# EAGLE design lpmon (EAGLE 9.2.2)
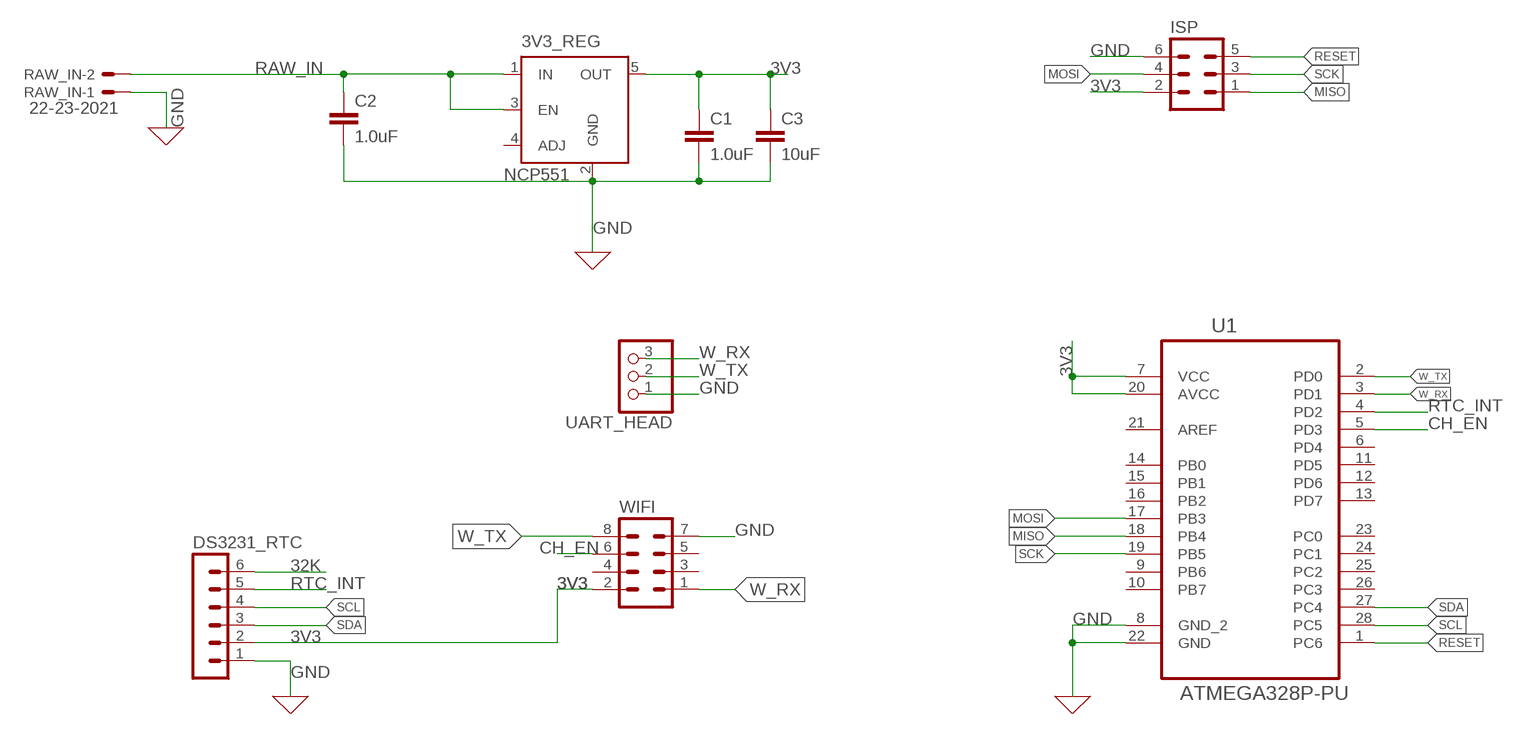
[diagram p0: schematic, sheet 1]

## Parts
3V3_REG  NCP551  MIC5219BM5  [SOT23-5]
C1  1.0uF  C2.5/2  [C2.5-2]
C2  1.0uF  C2.5/2  [C2.5-2]
C3  10uF  C2.5/2  [C2.5-2]
DS3231_RTC  MA06-1  [MA06-1]
ISP  MA03-2  [MA03-2]
RAW_IN  22-23-2021  [22-23-2021]
U1  ATMEGA328P-PU  [DIP254P762X457-28]
UART_HEAD  PINHD-1X3  [1X03]
WIFI  MA04-2  [MA04-2]

## Nets
3V3: 3V3_REG.5(OUT) C1.1 C3.1 DS3231_RTC.2 ISP.2 U1.7(VCC) U1.20(AVCC) WIFI.2
32K: DS3231_RTC.6
CH_EN: U1.5(PD3) WIFI.6
GND: 3V3_REG.2(GND) C1.2 C2.2 C3.2 DS3231_RTC.1 ISP.6 RAW_IN.1 U1.8(GND_2) U1.22(GND) UART_HEAD.1 WIFI.7
MISO: ISP.1 U1.18(PB4)
MOSI: ISP.4 U1.17(PB3)
RAW_IN: 3V3_REG.1(IN) 3V3_REG.3(EN) C2.1 RAW_IN.2
RESET: ISP.5 U1.1(PC6)
RTC_INT: DS3231_RTC.5 U1.4(PD2)
SCK: ISP.3 U1.19(PB5)
SCL: DS3231_RTC.4 U1.28(PC5)
SDA: DS3231_RTC.3 U1.27(PC4)
W_RX: U1.3(PD1) UART_HEAD.3 WIFI.1
W_TX: U1.2(PD0) UART_HEAD.2 WIFI.8
Unconnected: 3V3_REG.4(ADJ) U1.6(PD4) U1.9(PB6) U1.10(PB7) U1.11(PD5) U1.12(PD6) U1.13(PD7) U1.14(PB0) U1.15(PB1) U1.16(PB2) U1.21(AREF) U1.23(PC0) U1.24(PC1) U1.25(PC2) U1.26(PC3) WIFI.3 WIFI.4 WIFI.5

## Library data of the parts
3V3_REG = v-reg-micrel:MIC5219BM5: VOLTAGE REGULATOR; MF: ALTERA CORPORATION; MPN: MIC5219BM5 TR; OC_FARNELL: 1100656; OC_NEWARK: 09J8939
C1-C3 = capacitor-wima:C: CAPACITOR naming: grid - package width
DS3231_RTC = con-lstb:MA06-1: PIN HEADER; OC_FARNELL: unknown; OC_NEWARK: unknown
ISP = con-lstb:MA03-2: PIN HEADER; OC_FARNELL: unknown; OC_NEWARK: unknown
RAW_IN = con-molex:22-23-2021: .100" (2.54mm) Center Header - 2 Pin; MF: MOLEX; MPN: 22-23-2021; OC_FARNELL: 1462926; OC_NEWARK: 25C3832
U1 = Atmel_By_element14_Batch_1-00:ATMEGA328P-PU: 8-bit Microcontroller with In-System Programmable Flash; MPN: ATMEGA328P-PU; OC_FARNELL: 1715487; OC_NEWARK: 15R0268; PACKAGE: PDIP-28; SUPPLIER: Atmel
UART_HEAD = pinhead:PINHD-1X3: PIN HEADER
WIFI = con-lstb:MA04-2: PIN HEADER; OC_FARNELL: unknown; OC_NEWARK: unknown

## Board
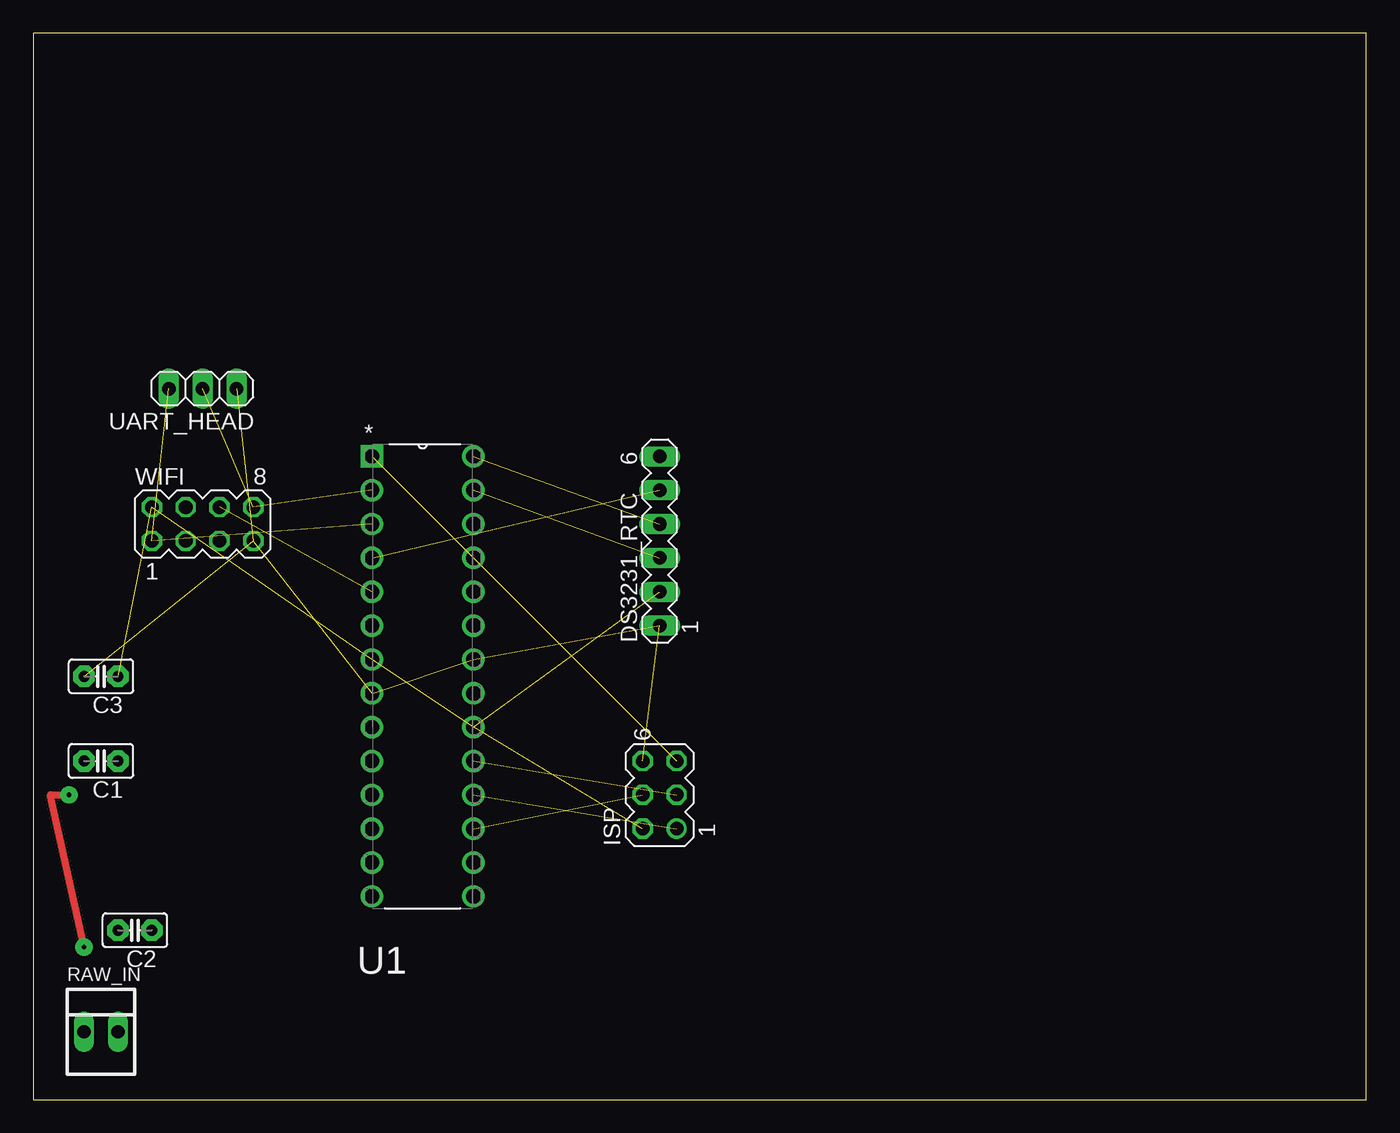
[diagram p1: board, top side]
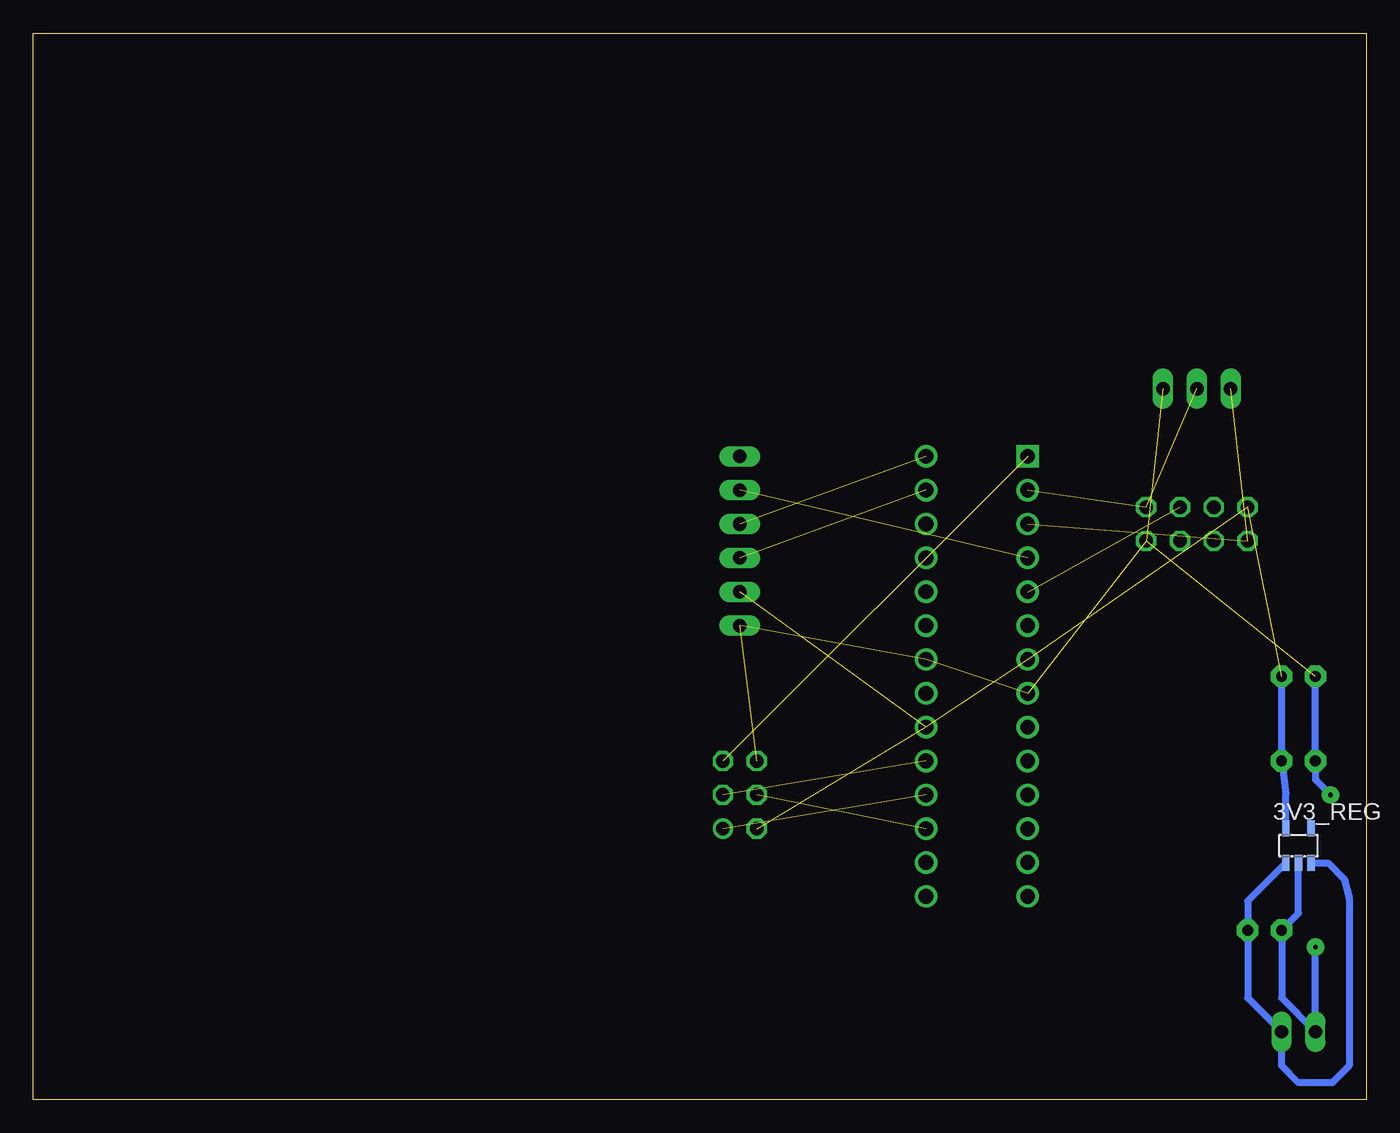
[diagram p2: board, bottom side, seen from below]

Size 100 x 80 mm. Coordinates in mm from the lower left corner, seen from the top.
Outline: 0,0 100,0 100,80 0,80 0,0
Copper layers (1*16): Top 0.035mm / dielectric 1.5mm / Bottom 0.035mm
Design rules "default": minimum track width 6mil, minimum drill 0.35mm, track to track 6mil, track to pad 6mil, pad to pad 6mil, via to via 6mil, smd to smd 6mil, copper to edge 40mil, drill to drill 6mil, minimum pad ring 10mil, minimum via ring 8mil, stop-mask expansion 4mil, vias tented up to drill 0mil, thermal gap 10mil

### Footprints (pad centres in the part's own frame; a part is rotated, then mirrored left to right if it is on the bottom)
SOT23-5 = smd 0.55 x 1.2: 1 -0.95,-1.3; 2 0,-1.3; 3 0.95,-1.3; 4 0.95,1.3; 5 -0.95,1.3
C2.5-2 = drill 0.813 pad 1.6 octagon: 1 -1.27,0; 2 1.27,0
MA06-1 = drill 1.016 long: 1 -6.35,0; 2 -3.81,0; 3 -1.27,0; 4 1.27,0; 5 3.81,0; 6 6.35,0
MA03-2 = drill 1.016: 1 -2.54,-1.27 | drill 1.016 octagon: 2 -2.54,1.27; 3 0,-1.27; 4 0,1.27; 5 2.54,-1.27; 6 2.54,1.27
22-23-2021 = drill 1 long: 1 -1.27,0; 2 1.27,0
DIP254P762X457-28 = drill 1.118 square: 1 -7.62,33.02 | drill 1.118: 2 -7.62,30.48; 3 -7.62,27.94; 4 -7.62,25.4; 5 -7.62,22.86; 6 -7.62,20.32; 7 -7.62,17.78; 8 -7.62,15.24; 9 -7.62,12.7; 10 -7.62,10.16; 11 -7.62,7.62; 12 -7.62,5.08; 13 -7.62,2.54; 14 -7.62,0; 15 0,0; 16 0,2.54; 17 0,5.08; 18 0,7.62; 19 0,10.16; 20 0,12.7; 21 0,15.24; 22 0,17.78; 23 0,20.32; 24 0,22.86; 25 0,25.4; 26 0,27.94; 27 0,30.48; 28 0,33.02
1X03 = drill 1.016 long: 1 -2.54,0; 2 0,0; 3 2.54,0
MA04-2 = drill 1.016 octagon: 1 -3.81,-1.27; 2 -3.81,1.27; 3 -1.27,-1.27; 4 -1.27,1.27; 5 1.27,-1.27; 6 1.27,1.27; 7 3.81,-1.27; 8 3.81,1.27

### Placement (x,y rotation side)
3V3_REG  5.08,19.05 0 bottom
C1  5.08,25.4 180 top
C2  7.62,12.7 180 top
C3  5.08,31.75 180 top
DS3231_RTC  46.99,41.91 90 top
ISP  46.99,22.86 90 top
RAW_IN  5.08,5.08 0 top
U1  33.02,15.24 0 top
UART_HEAD  12.7,53.34 180 top
WIFI  12.7,43.18 0 top

### Tracks (layer width: path | path; a pad name or v marks a point on that pad's centre or on a via)
3V3  (5 unrouted)
  Bottom 0.508: C3.1 C1.1 6.03,22.89 3V3_REG.5
CH_EN  (1 unrouted)
GND  (via drill 0.35 pad 1.3)  (6 unrouted)
  Top 0.508: v3.81,11.43 1.27,22.86 v2.66,22.86
  Bottom 0.508: 3V3_REG.2 5.08,13.97 C2.2 6.35,7.62 RAW_IN.1 v3.81,11.43 | v2.66,22.86 3.81,24.01 C1.2 C3.2
MISO  (1 unrouted)
MOSI  (1 unrouted)
RAW_IN
  Bottom 0.508: 3V3_REG.1 8.89,14.89 C2.1 8.89,7.62 RAW_IN.2 6.35,2.54 5.08,1.27 2.54,1.27 1.27,2.54 1.27,15.08 1.65,16.54 2.86,17.75 3V3_REG.3
RESET  (1 unrouted)
RTC_INT  (1 unrouted)
SCK  (1 unrouted)
SCL  (1 unrouted)
SDA  (1 unrouted)
W_RX  (2 unrouted)
W_TX  (2 unrouted)